# Altium schematic sheet sensor.SchDoc
size A4; SheetNumber: 3; SheetTotal: 3
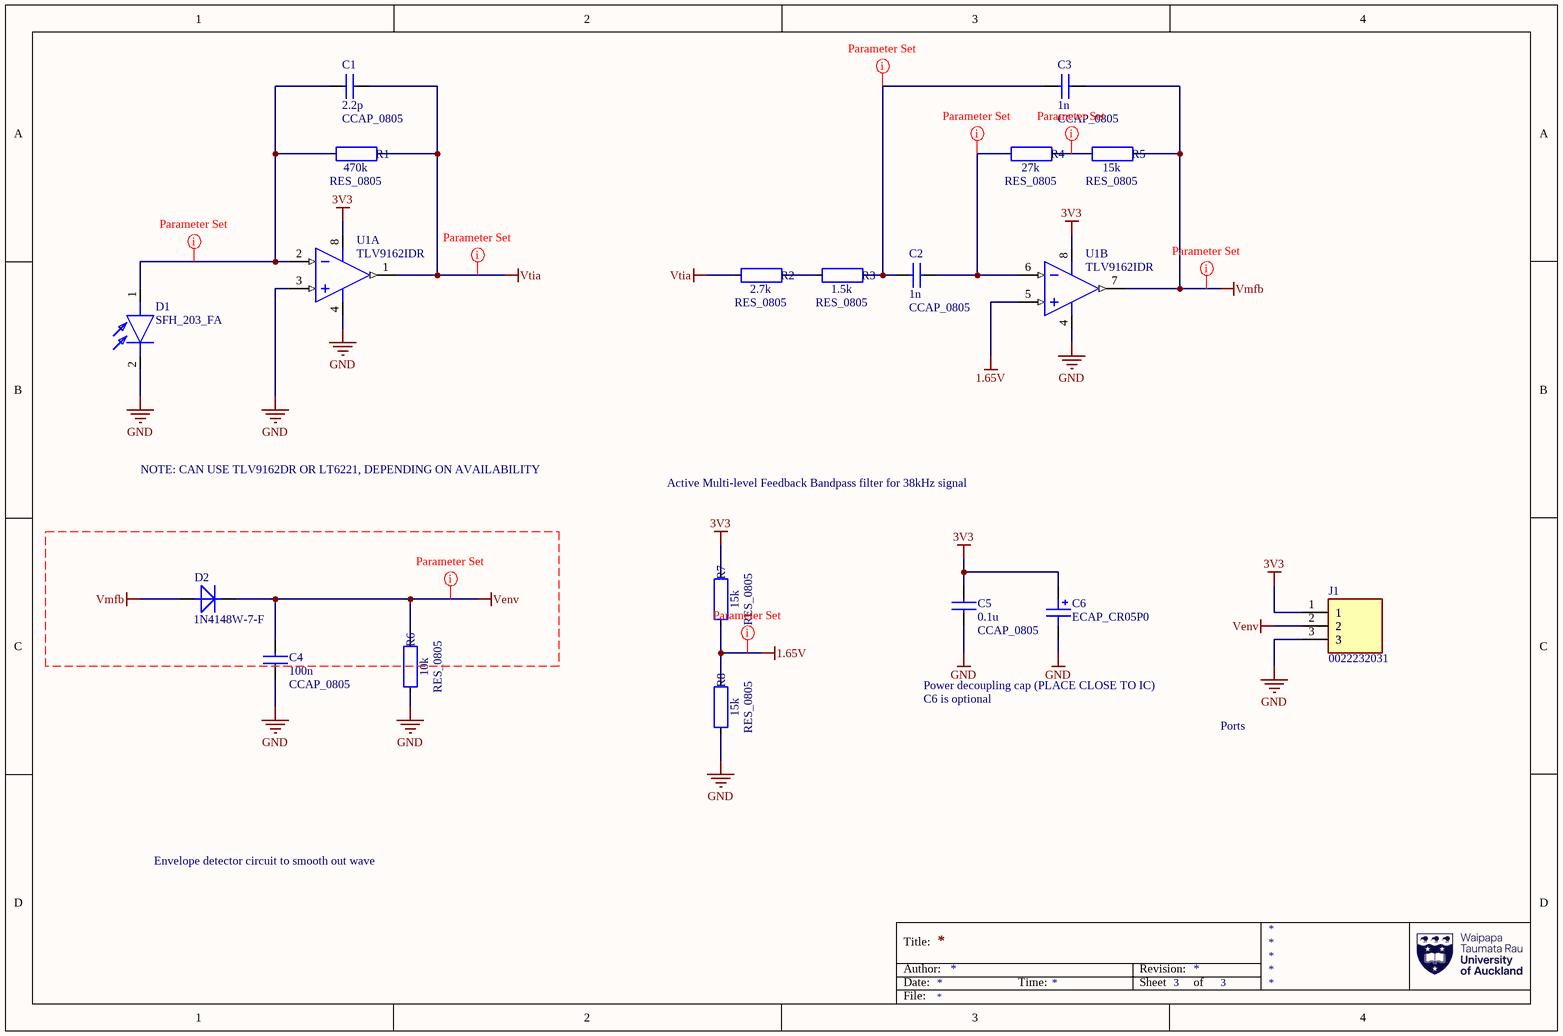
[diagram p0: sensor.SchDoc]

## Parts
C1  CCAP_0805  value 2.2p  [C0805]
C2  CCAP_0805  value 1n  [C0805]
C3  CCAP_0805  value 1n  [C0805]
C4  CCAP_0805  value 100n  [C0805]
C5  CCAP_0805  value 0.1u  [C0805]
C6  ECAP_CR05P0  [EC_CR05]
D1  SFH_203_FA  [SFH203FA]
D2  1N4148W-7-F  [SOD123]
J1  0022232031  [HDRV3W87P0X254_1X3_747X635X1105P]
R1  RES_0805  value 470k  [R0805]
R2  RES_0805  value 2.7k  [R0805]
R3  RES_0805  value 1.5k  [R0805]
R4  RES_0805  value 27k  [R0805]
R5  RES_0805  value 15k  [R0805]
R6  RES_0805  value 10k  [R0805]
R7  RES_0805  value 15k  [R0805]
R8  RES_0805  value 15k  [R0805]
U1  TLV9162IDR  [SOIC8-Ti-Footprint]  (parts A,B of 2)

## Nets
1.65V: R7.1 R8.2 U1.5(2IN+)
3V3: C5.2 C6.1 J1.1 R7.2 U1.8(VCC)
GND: C4.2 C5.1 C6.2 D1.2(K) J1.3 R6.1 R8.1 U1.3(1IN+) U1.4(GND)
Venv: C4.1 D2.1(K) J1.2 R6.2
Vmfb: C3.1 D2.2(A) R5.2 U1.7(2OUT)
Vtia: C1.1 R1.2 R2.1 U1.1(1OUT)
NetC1_2: C1.2 D1.1(A) R1.1 U1.2(1IN-)
NetC2_1: C2.1 R4.1 U1.6(2IN-)
NetC2_2: C2.2 C3.2 R3.2
NetR2_2: R2.2 R3.1
NetR4_2: R4.2 R5.1

## Layout directives
net class Signals: 1.65V, NetC1_2, NetC2_1, NetC2_2, NetR4_2, Venv, Vmfb, Vtia

## Notes on the sheet
- NOTE: CAN USE TLV9162DR OR LT6221, DEPENDING ON AVAILABILITY
- Active Multi-level Feedback Bandpass filter for 38kHz signal
- Power decoupling cap (PLACE CLOSE TO IC)
- C6 is optional
- Ports
- Envelope detector circuit to smooth out wave
- Title:
- Author:
- Date:
- Time:
- Revision:
- Sheet
- of
- File:

## Library data of the parts
C1-C5 = CMP-00003-4: Generic 0805 cramic capacitor
C6 = CMP-001-00002-5: Generic 5mm pitch TH radial electrolytic capacitor; Value: 10u
D1 = SFH_203_FA: LED; Manufacturer_Name: ams OSRAM; Manufacturer_Part_Number: SFH 203 FA; Datasheet Link: https://datasheet.datasheetarchive.com/originals/distributors/DKDS41/DSANUWW0036828.pdf; Height: 8.9mm; Mouser Part Number: 720-SFH203FA; Mouser Price/Stock: https://www.mouser.co.uk/ProductDetail/ams-OSRAM/SFH-203-FA?qs=K5ta8V%252BWhtaq1pinUuBcnA%3D%3D
D2 = CMP-004-00000-2: Small Signal Diode, Single, 100 V, 300 mA, 4ns, SOD-123; Current Rating: 150mA; Value: 2pF; Forward Voltage: 715mV
J1 = 0022232031: Connector; Manufacturer_Name: Molex; Datasheet Link: https://www.molex.com/en-us/products/part-detail-pdf/22232031?display=pdf; Height: 11.05mm; Manufacturer_Part_Number: 0022232031; Mouser Part Number: N/A; Mouser Price/Stock: https://www.mouser.co.uk/ProductDetail/Molex/0022232031?qs=PBcRNPEHKsqLjUBIVcYwpw%3D%3D; Arrow Part Number: 0022232031; Arrow Price/Stock: https://www.arrow.com/en/products/0022232031/molex?utm_currency=USD&region=europe
R1-R8 = CMP-00002-12: Generic 0805 resistor; Voltage Rating: 150V; Package: 0805
U1 = CMP-001-0004-1: Dual 10pA 33V/us 11MHz SOIC-8 Operational Amplifier ROHS; Case/Package: SOIC